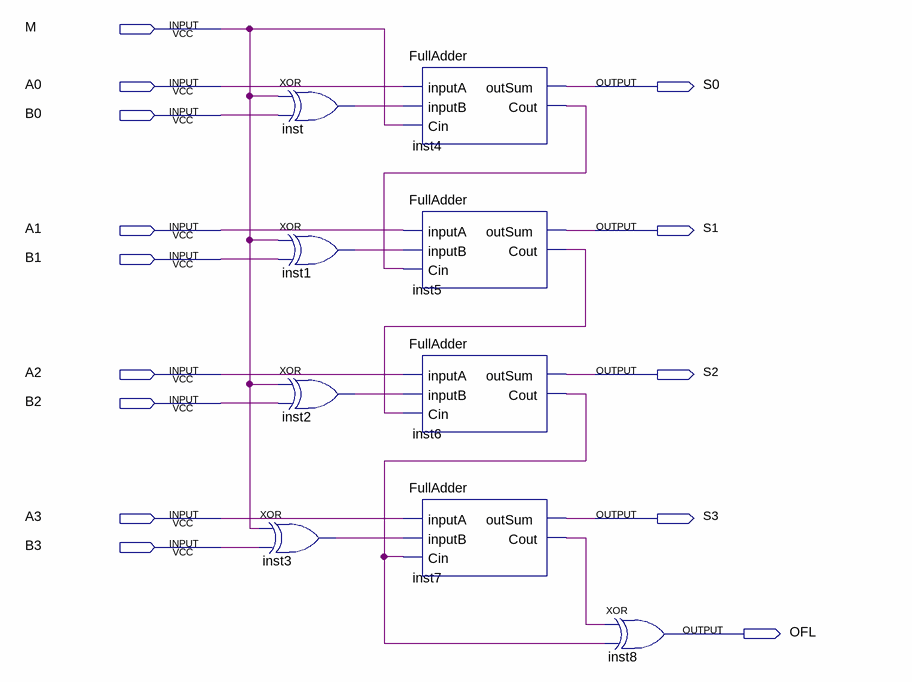
[diagram p0: schematic sheet]
// Quartus schematic AddSub4.bdf as structural Verilog: 9 symbols, 14 pins
module AddSub4 (
  input  M,
  input  A0,
  input  B0,
  input  A1,
  input  B1,
  input  A2,
  input  B2,
  input  A3,
  input  B3,
  output S0,
  output S1,
  output S2,
  output S3,
  output OFL
);

  wire inst1_out, inst2_out, inst3_out, inst4_cout, inst5_cout, inst6_cout, inst7_cout, inst_out;

  xor inst3 (inst3_out, M, B3);
  xor inst (inst_out, M, B0);
  xor inst1 (inst1_out, M, B1);
  xor inst2 (inst2_out, M, B2);
  FullAdder inst4 (.inputA(A0), .inputB(inst_out), .Cin(M), .outSum(S0), .Cout(inst4_cout));
  FullAdder inst5 (.inputA(A1), .inputB(inst1_out), .Cin(inst4_cout), .outSum(S1), .Cout(inst5_cout));
  FullAdder inst6 (.inputA(A2), .inputB(inst2_out), .Cin(inst5_cout), .outSum(S2), .Cout(inst6_cout));
  FullAdder inst7 (.inputA(A3), .inputB(inst3_out), .Cin(inst6_cout), .outSum(S3), .Cout(inst7_cout));
  xor inst8 (OFL, inst7_cout, inst6_cout);
endmodule
